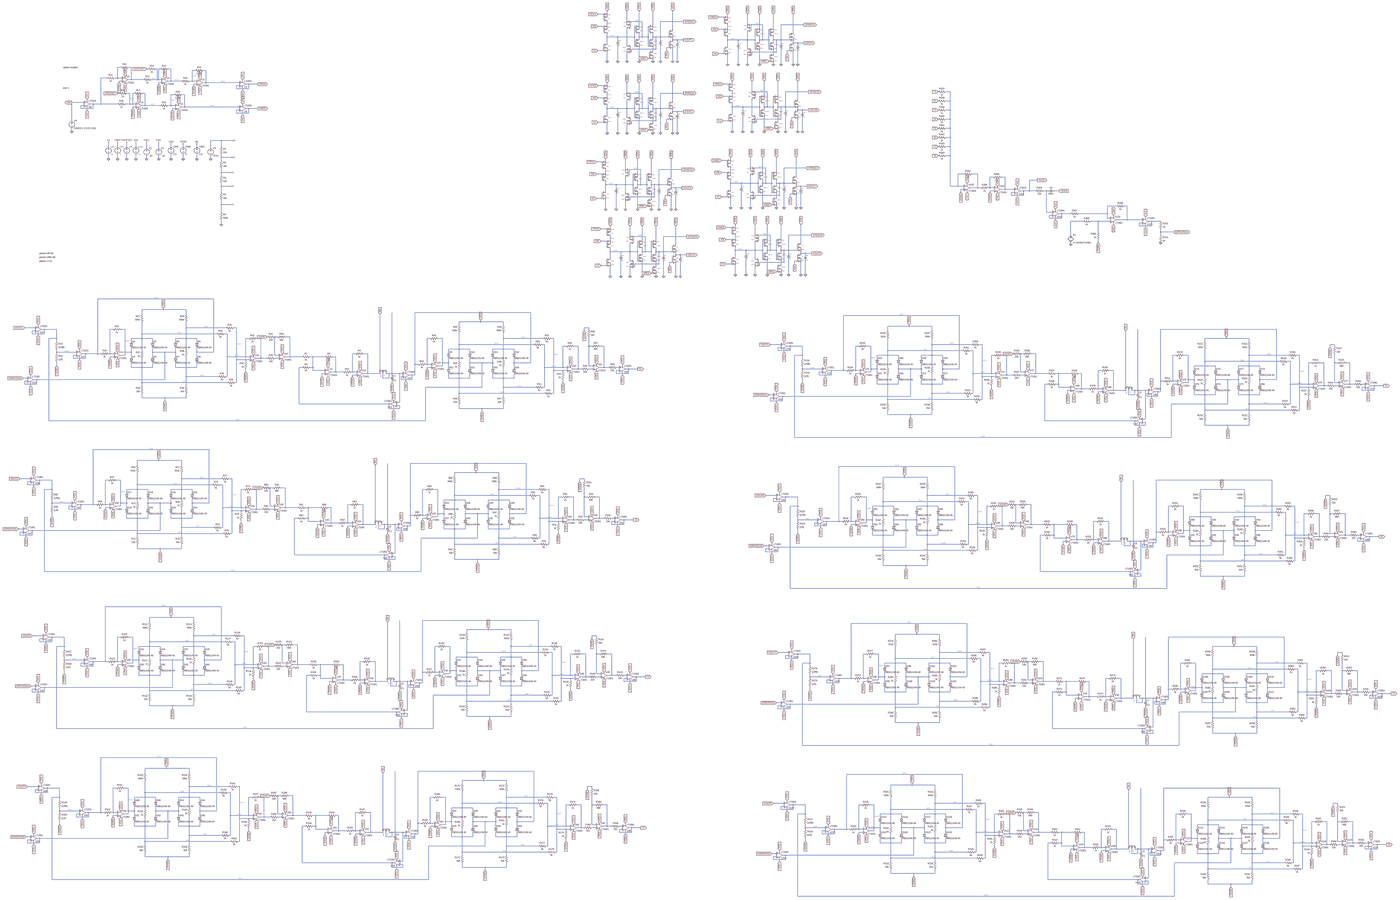
[diagram p0: schematic OZ_8_bounded_curves.asc, whole sheet]
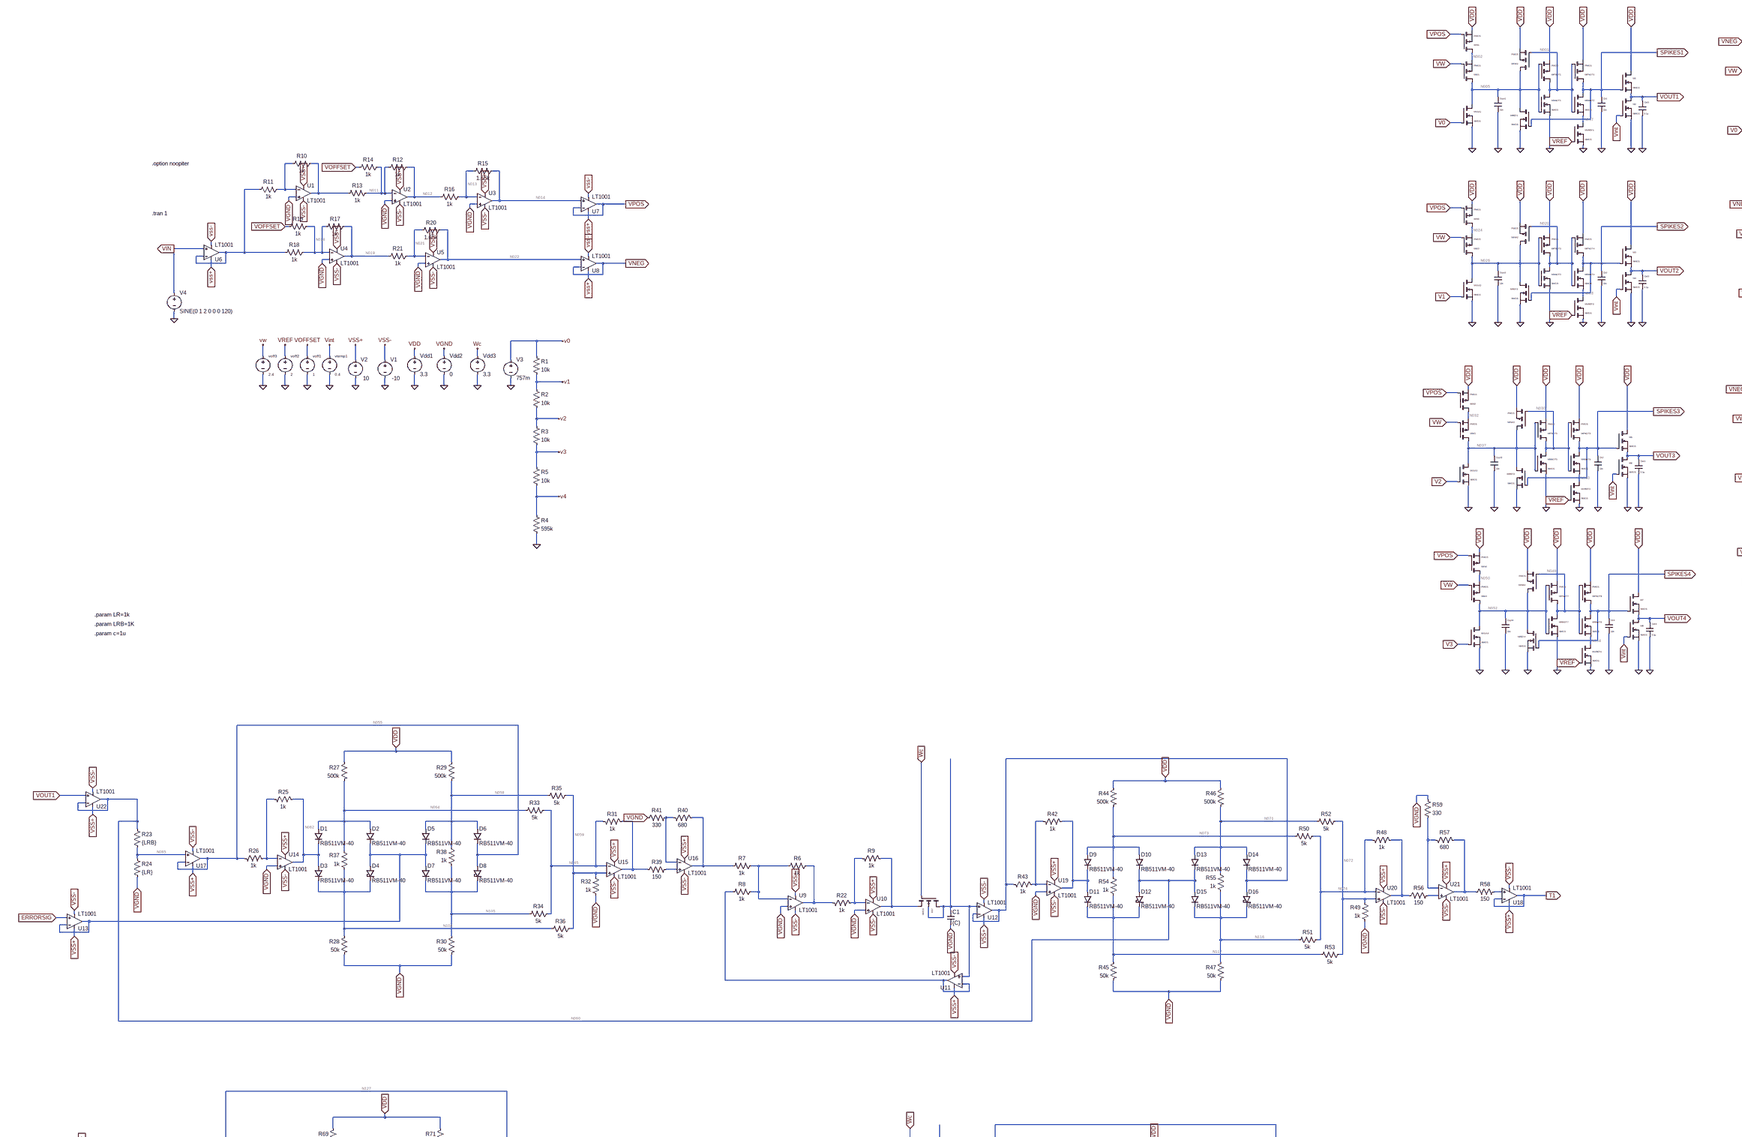
[diagram p1: schematic OZ_8_bounded_curves.asc, part, row 1 of 2, column 1 of 2]
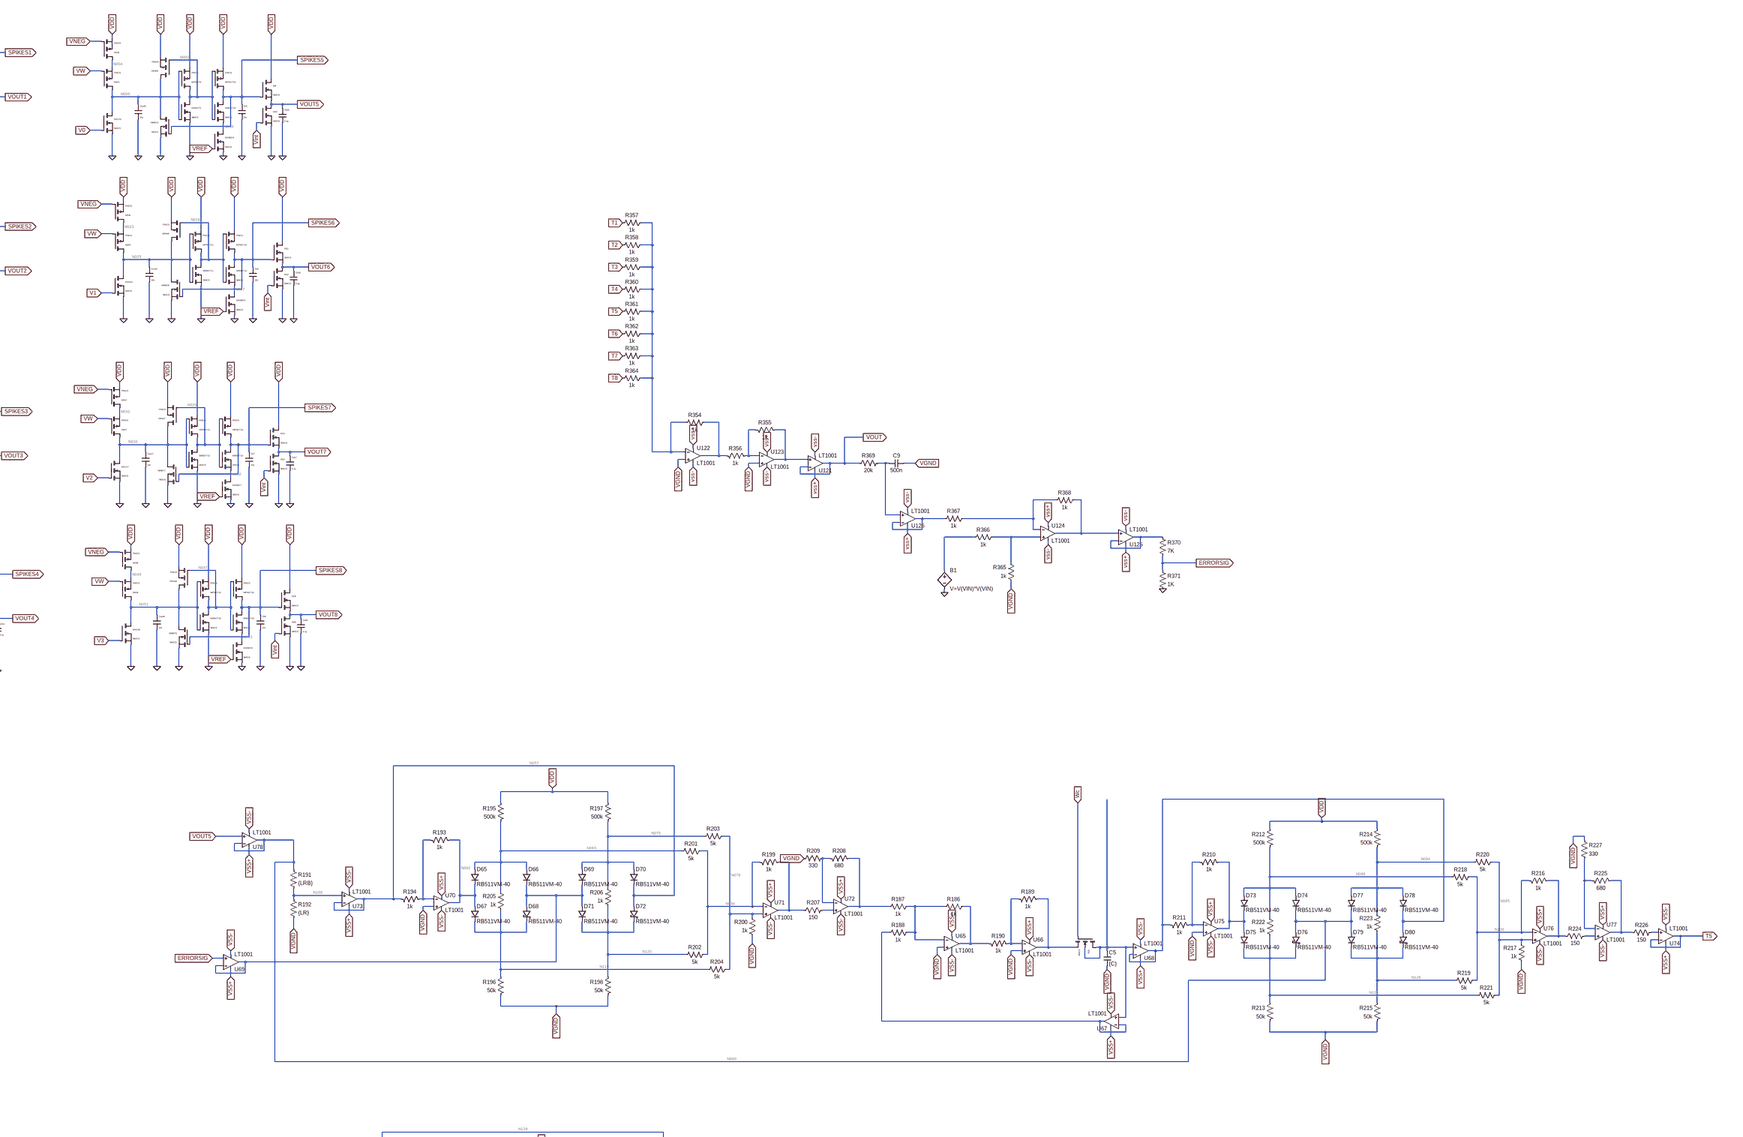
[diagram p2: schematic OZ_8_bounded_curves.asc, part, row 1 of 2, column 2 of 2]
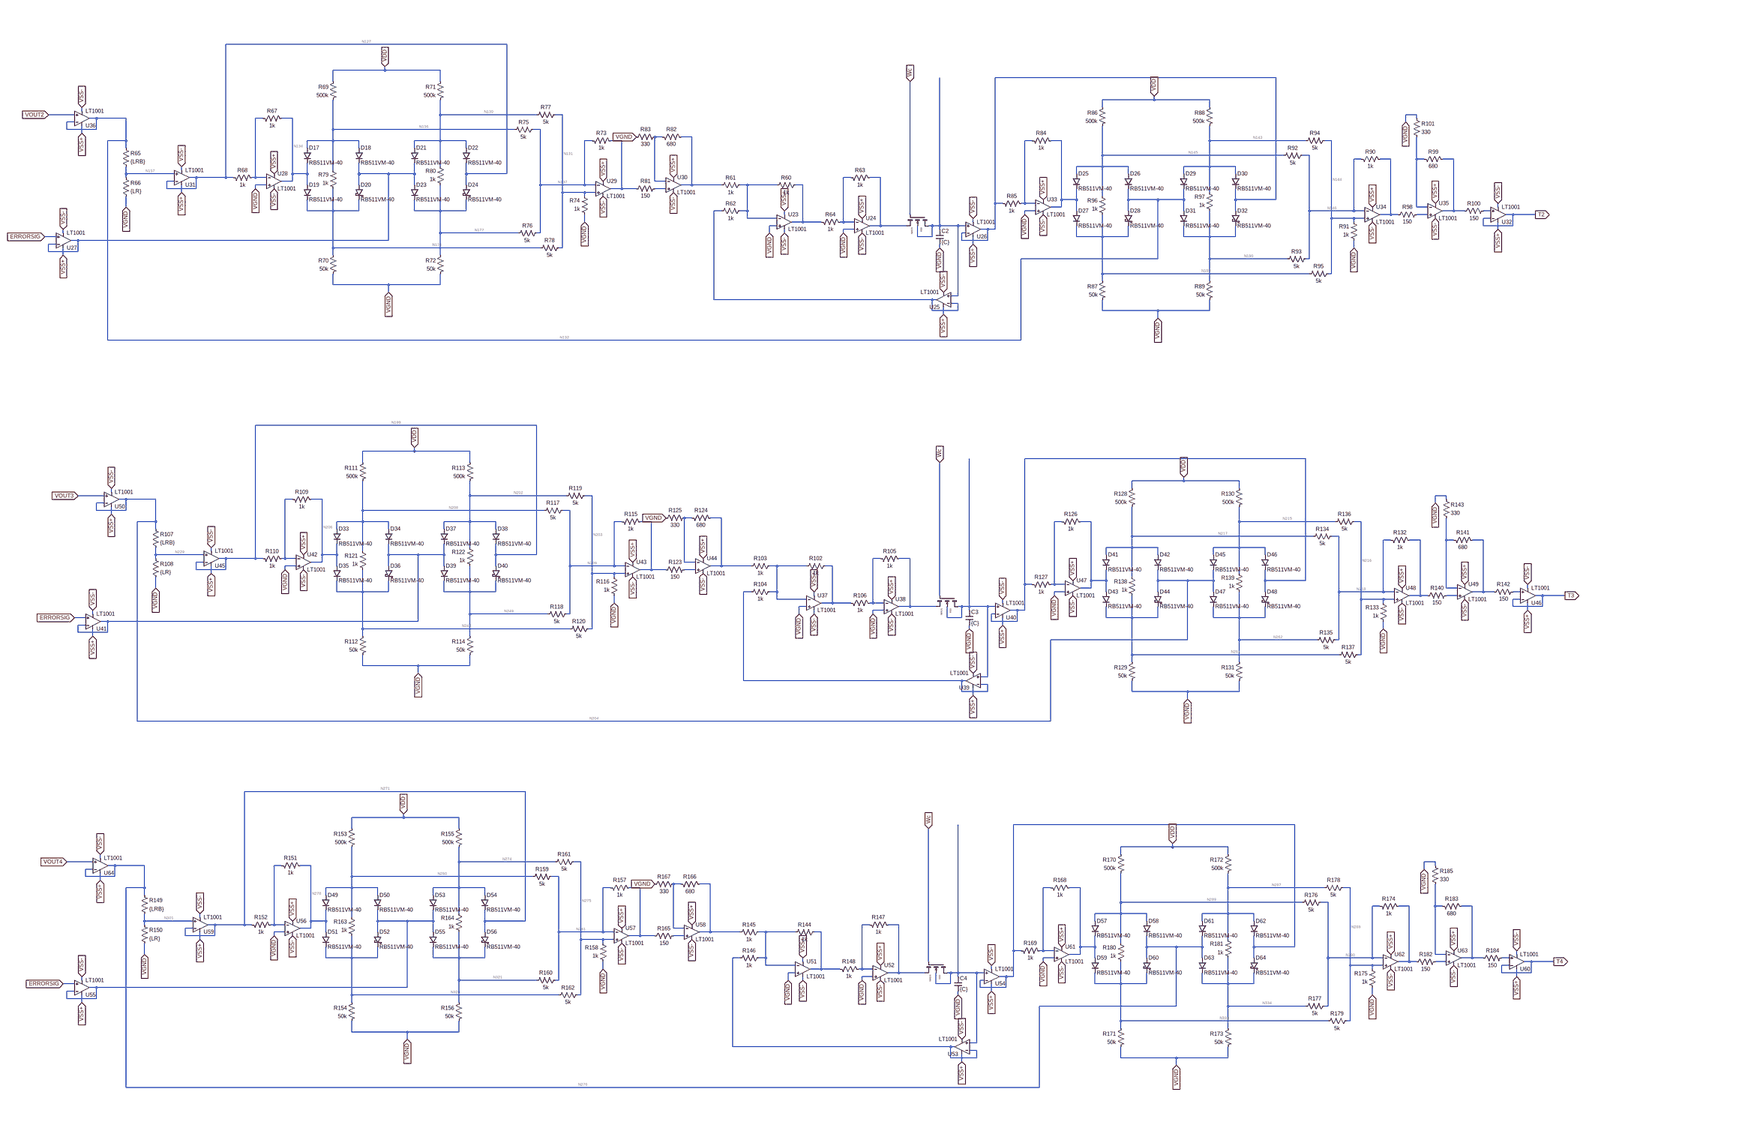
[diagram p3: schematic OZ_8_bounded_curves.asc, part, row 2 of 2, column 1 of 2]
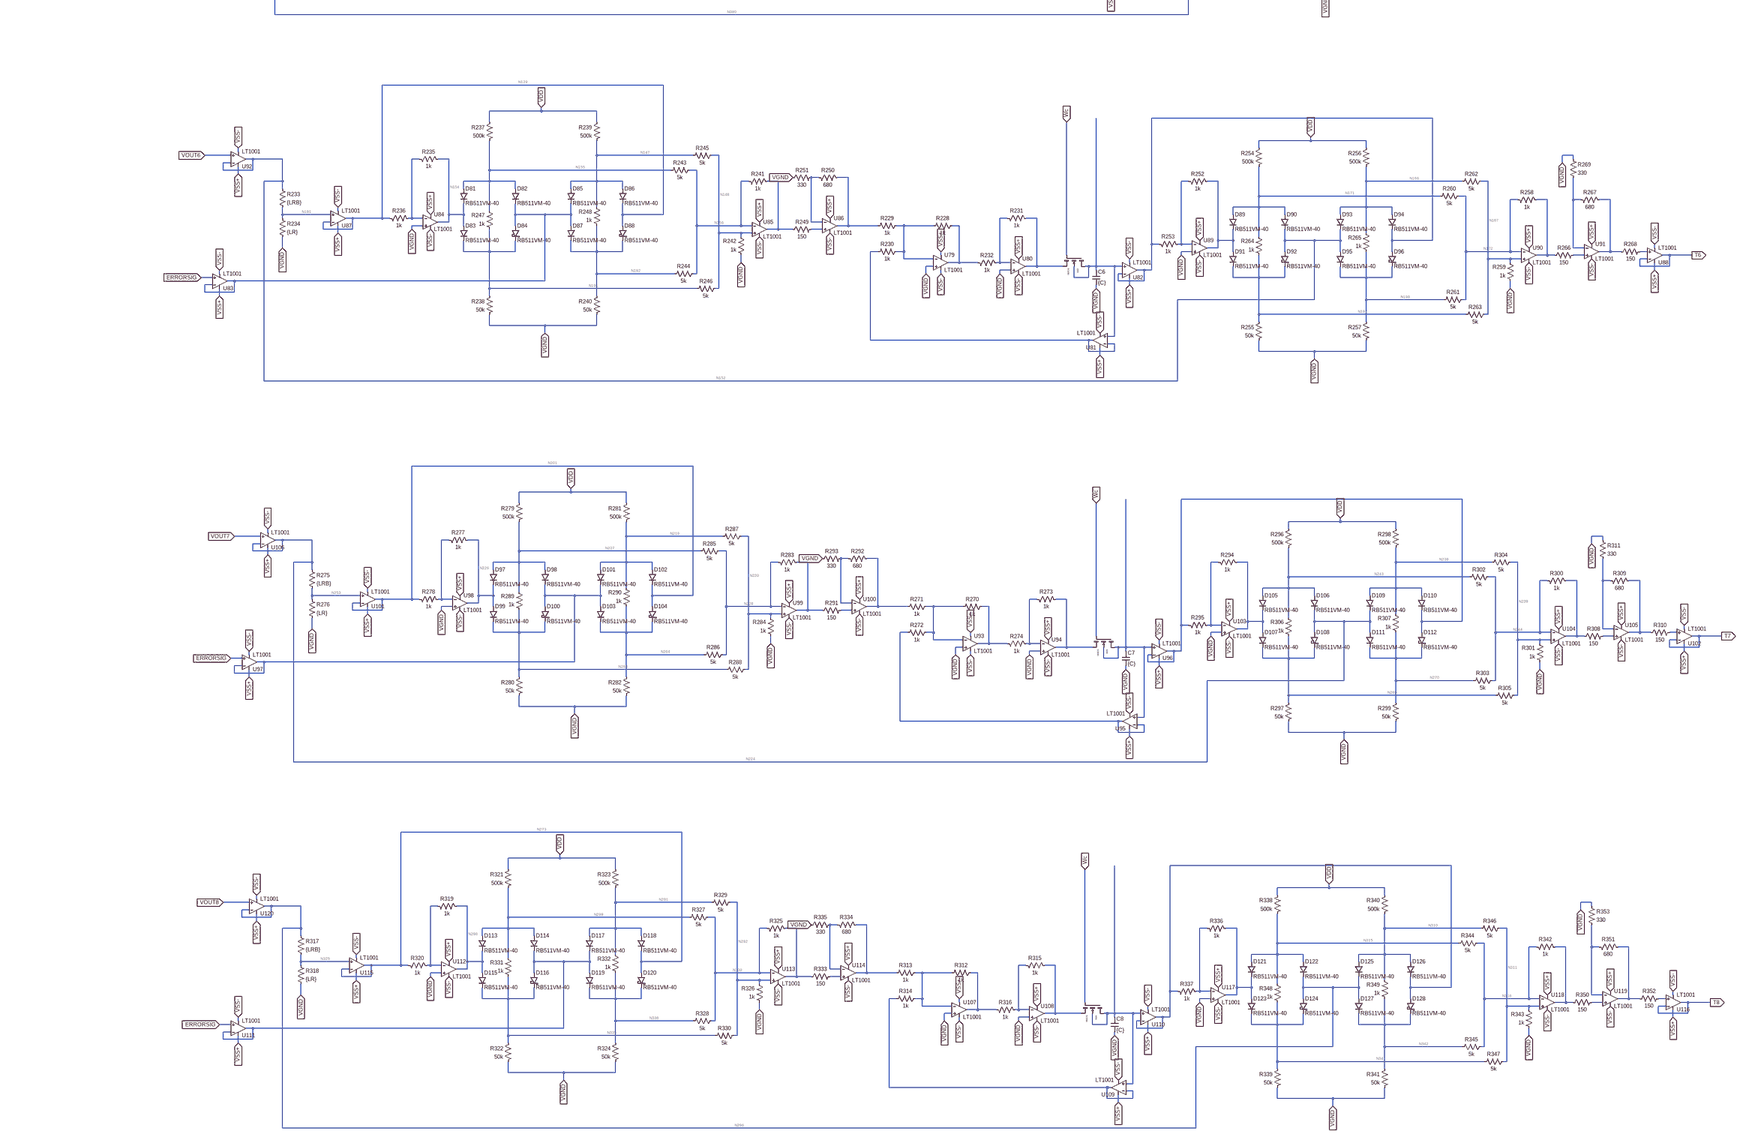
[diagram p4: schematic OZ_8_bounded_curves.asc, part, row 2 of 2, column 2 of 2]
* OZ_8_bounded_curves.asc
vtemp1 Vint 0 0.4
Vdd1 VDD 0 3.3
V1 VSS- 0 -10
V2 VSS+ 0 10
voff1 VOFFSET 0 1
voff2 VREF 0 2
voff3 vw 0 2.4
Vdd2 VGND 0 0
XU1 VGND N009 VSS+ VSS- N010 LT1001  ; pins In+ In- V+ V- OUT
R10 N010 N009 1k
R11 N009 N015 1k
XU2 VGND N011 VSS+ VSS- N012 LT1001  ; pins In+ In- V+ V- OUT
R12 N012 N011 1k
R13 N011 N010 1k
R14 N011 VOFFSET 1k
XU3 VGND N013 VSS+ VSS- N014 LT1001  ; pins In+ In- V+ V- OUT
R15 N014 N013 1.65k
R16 N013 N012 1k
XU4 VGND N018 VSS+ VSS- N019 LT1001  ; pins In+ In- V+ V- OUT
R17 N019 N018 1k
R18 N018 N015 1k
R19 N018 VOFFSET 1k
XU5 VGND N021 VSS+ VSS- N022 LT1001  ; pins In+ In- V+ V- OUT
R20 N022 N021 1.65k
R21 N021 N019 1k
XU6 VIN N015 VSS+ VSS- N015 LT1001  ; pins In+ In- V+ V- OUT
XU7 N014 VPOS VSS+ VSS- VPOS LT1001  ; pins In+ In- V+ V- OUT
XU8 N022 VNEG VSS+ VSS- VNEG LT1001  ; pins In+ In- V+ V- OUT
MW1 N005 vw N002 N002 PMOS
Csyn1 N005 0 10n V=4 Irms=162m Rser=0.395426 Lser=0 mfg="KEMET" pn="C0402C103K7PAC" type="X5R" IC=0
Ck1 SPIKES1 0 10n
MPNOT1 N001 N005 VDD VDD PMOS
MNNOT1 N001 N005 0 0 NMOS
MVREF1 N007 VREF 0 0 NMOS
MREF1 N005 SPIKES1 0 0 NMOS
MVLK1 N005 V0 0 0 NMOS
MINA1 N005 N001 VDD VDD PMOS
MIN1 N002 VPOS VDD VDD PMOS
MPNOT2 SPIKES1 N001 VDD VDD PMOS
MNNOT2 SPIKES1 N001 N007 N007 NMOS
M1 VDD SPIKES1 VOUT1 VOUT1 NMOS
M2 VOUT1 Vint 0 0 NMOS
Cint1 VOUT1 0 0.1µ
MW2 N026 vw N024 N024 PMOS
Csyn2 N026 0 10n V=4 Irms=162m Rser=0.395426 Lser=0 mfg="KEMET" pn="C0402C103K7PAC" type="X5R" IC=0
Ck2 SPIKES2 0 10n
MPNOT3 N020 N026 VDD VDD PMOS
MNNOT3 N020 N026 0 0 NMOS
MVREF2 N028 VREF 0 0 NMOS
MREF2 N026 SPIKES2 0 0 NMOS
MVLK2 N026 V1 0 0 NMOS
MINA2 N026 N020 VDD VDD PMOS
MIN2 N024 VPOS VDD VDD PMOS
MPNOT4 SPIKES2 N020 VDD VDD PMOS
MNNOT4 SPIKES2 N020 N028 N028 NMOS
M3 VDD SPIKES2 VOUT2 VOUT2 NMOS
M4 VOUT2 Vint 0 0 NMOS
Cint2 VOUT2 0 0.1µ
MW3 N037 vw N032 N032 PMOS
Csyn3 N037 0 10n V=4 Irms=162m Rser=0.395426 Lser=0 mfg="KEMET" pn="C0402C103K7PAC" type="X5R" IC=0
Ck3 SPIKES3 0 10n
MPNOT5 N030 N037 VDD VDD PMOS
MNNOT5 N030 N037 0 0 NMOS
MVREF3 N040 VREF 0 0 NMOS
MREF3 N037 SPIKES3 0 0 NMOS
MVLK3 N037 V2 0 0 NMOS
MINA3 N037 N030 VDD VDD PMOS
MIN3 N032 VPOS VDD VDD PMOS
MPNOT6 SPIKES3 N030 VDD VDD PMOS
MNNOT6 SPIKES3 N030 N040 N040 NMOS
M5 VDD SPIKES3 VOUT3 VOUT3 NMOS
M6 VOUT3 Vint 0 0 NMOS
Cint3 VOUT3 0 0.1µ
MW4 N052 vw N050 N050 PMOS
Csyn4 N052 0 10n V=4 Irms=162m Rser=0.395426 Lser=0 mfg="KEMET" pn="C0402C103K7PAC" type="X5R" IC=0
Ck4 SPIKES4 0 10n
MPNOT7 N048 N052 VDD VDD PMOS
MNNOT7 N048 N052 0 0 NMOS
MVREF4 N054 VREF 0 0 NMOS
MREF4 N052 SPIKES4 0 0 NMOS
MVLK4 N052 V3 0 0 NMOS
MINA4 N052 N048 VDD VDD PMOS
MIN4 N050 VPOS VDD VDD PMOS
MPNOT8 SPIKES4 N048 VDD VDD PMOS
MNNOT8 SPIKES4 N048 N054 N054 NMOS
M7 VDD SPIKES4 VOUT4 VOUT4 NMOS
M8 VOUT4 Vint 0 0 NMOS
Cint4 VOUT4 0 0.1µ
MW5 N006 vw N004 N004 PMOS
Csyn5 N006 0 10n V=4 Irms=162m Rser=0.395426 Lser=0 mfg="KEMET" pn="C0402C103K7PAC" type="X5R" IC=0
Ck5 SPIKES5 0 10n
MPNOT9 N003 N006 VDD VDD PMOS
MNNOT9 N003 N006 0 0 NMOS
MVREF5 N008 VREF 0 0 NMOS
MREF5 N006 SPIKES5 0 0 NMOS
MVLK5 N006 V0 0 0 NMOS
MINA5 N006 N003 VDD VDD PMOS
MIN5 N004 VNEG VDD VDD PMOS
MPNOT10 SPIKES5 N003 VDD VDD PMOS
MNNOT10 SPIKES5 N003 N008 N008 NMOS
M9 VDD SPIKES5 VOUT5 VOUT5 NMOS
M10 VOUT5 Vint 0 0 NMOS
Cint5 VOUT5 0 0.1µ
MW6 N025 vw N023 N023 PMOS
Csyn6 N025 0 10n V=4 Irms=162m Rser=0.395426 Lser=0 mfg="KEMET" pn="C0402C103K7PAC" type="X5R" IC=0
Ck6 SPIKES6 0 10n
MPNOT11 N016 N025 VDD VDD PMOS
MNNOT11 N016 N025 0 0 NMOS
MVREF6 N027 VREF 0 0 NMOS
MREF6 N025 SPIKES6 0 0 NMOS
MVLK6 N025 V1 0 0 NMOS
MINA6 N025 N016 VDD VDD PMOS
MIN6 N023 VNEG VDD VDD PMOS
MPNOT12 SPIKES6 N016 VDD VDD PMOS
MNNOT12 SPIKES6 N016 N027 N027 NMOS
M11 VDD SPIKES6 VOUT6 VOUT6 NMOS
M12 VOUT6 Vint 0 0 NMOS
Cint6 VOUT6 0 0.1µ
MW7 N036 vw N031 N031 PMOS
Csyn7 N036 0 10n V=4 Irms=162m Rser=0.395426 Lser=0 mfg="KEMET" pn="C0402C103K7PAC" type="X5R" IC=0
Ck7 SPIKES7 0 10n
MPNOT13 N029 N036 VDD VDD PMOS
MNNOT13 N029 N036 0 0 NMOS
MVREF7 N039 VREF 0 0 NMOS
MREF7 N036 SPIKES7 0 0 NMOS
MVLK7 N036 V2 0 0 NMOS
MINA7 N036 N029 VDD VDD PMOS
MIN7 N031 VNEG VDD VDD PMOS
MPNOT14 SPIKES7 N029 VDD VDD PMOS
MNNOT14 SPIKES7 N029 N039 N039 NMOS
M13 VDD SPIKES7 VOUT7 VOUT7 NMOS
M14 VOUT7 Vint 0 0 NMOS
Cint7 VOUT7 0 0.1µ
MW8 N051 vw N049 N049 PMOS
Csyn8 N051 0 10n V=4 Irms=162m Rser=0.395426 Lser=0 mfg="KEMET" pn="C0402C103K7PAC" type="X5R" IC=0
Ck8 SPIKES8 0 10n
MPNOT15 N047 N051 VDD VDD PMOS
MNNOT15 N047 N051 0 0 NMOS
MVREF8 N053 VREF 0 0 NMOS
MREF8 N051 SPIKES8 0 0 NMOS
MVLK8 N051 V3 0 0 NMOS
MINA8 N051 N047 VDD VDD PMOS
MIN8 N049 VNEG VDD VDD PMOS
MPNOT16 SPIKES8 N047 VDD VDD PMOS
MNNOT16 SPIKES8 N047 N053 N053 NMOS
M15 VDD SPIKES8 VOUT8 VOUT8 NMOS
M16 VOUT8 Vint 0 0 NMOS
Cint8 VOUT8 0 0.1µ
V3 V0 0 757m
R1 V0 V1 10k
R2 V1 V2 10k
R3 V2 V3 10k
R4 v4 0 595k
R5 V3 v4 10k
V4 VIN 0 SINE(0 1 2 0 0 0 120)
XU121 N035 VOUT VSS+ VSS- VOUT LT1001  ; pins In+ In- V+ V- OUT
XU122 VGND N017 VSS+ VSS- N033 LT1001  ; pins In+ In- V+ V- OUT
R354 N033 N017 1k
XU123 VGND N034 VSS+ VSS- N035 LT1001  ; pins In+ In- V+ V- OUT
R355 N034 N035 1k
R356 N033 N034 1k
R357 N017 T1 1k
R358 N017 T2 1k
R359 N017 T3 1k
R360 N017 T4 1k
R361 N017 T5 1k
R362 N017 T6 1k
R363 N017 T7 1k
R364 N017 T8 1k
M17 N113 Wc N088 N113 NMOS
C1 N113 VGND {C} IC=0
XU9 VGND N096 VSS+ VSS- N097 LT1001  ; pins In+ In- V+ V- OUT
R6 N097 N096 1k
R7 N096 N067 1k
R8 N096 N106 1k
XU10 VGND N087 VSS+ VSS- N088 LT1001  ; pins In+ In- V+ V- OUT
R9 N087 N088 1k
R22 N097 N087 1k
XU11 N113 N106 VSS+ VSS- N106 LT1001  ; pins In+ In- V+ V- OUT
XU12 N113 N056 VSS+ VSS- N056 LT1001  ; pins In+ In- V+ V- OUT
R23 N060 N085 {LRB}
R24 N085 VGND {LR}
XU13 ERRORSIG N086 VSS+ VSS- N086 LT1001  ; pins In+ In- V+ V- OUT
D1 N064 N062 RB511VM-40
XU14 VGND N061 VSS+ VSS- N062 LT1001  ; pins In+ In- V+ V- OUT
R25 N061 N062 1k
R26 N055 N061 1k
D2 N064 N086 RB511VM-40
D3 N062 N104 RB511VM-40
D4 N086 N104 RB511VM-40
R27 VDD N064 500k
R28 N104 VGND 50k
D5 N058 N086 RB511VM-40
D6 N058 N055 RB511VM-40
D7 N086 N105 RB511VM-40
D8 N055 N105 RB511VM-40
R29 VDD N058 500k
R30 N105 VGND 50k
XU15 N059 N065 VSS+ VSS- N068 LT1001  ; pins In+ In- V+ V- OUT
R31 N065 N068 1k
R32 VGND N059 1k
R33 N065 N064 5k
R34 N065 N105 5k
R35 N059 N058 5k
R36 N059 N104 5k
R37 N104 N064 1k
R38 N105 N058 1k
R39 N068 N098 150
XU16 N098 N066 VSS+ VSS- N067 LT1001  ; pins In+ In- V+ V- OUT
R40 N066 N067 680
R41 VGND N066 330
XU17 N085 N055 VSS+ VSS- N055 LT1001  ; pins In+ In- V+ V- OUT
XU18 N107 T1 VSS+ VSS- T1 LT1001  ; pins In+ In- V+ V- OUT
D9 N073 N070 RB511VM-40
XU19 VGND N069 VSS+ VSS- N070 LT1001  ; pins In+ In- V+ V- OUT
R42 N069 N070 1k
R43 N056 N069 1k
D10 N073 N060 RB511VM-40
D11 N070 N117 RB511VM-40
D12 N060 N117 RB511VM-40
R44 VDD N073 500k
R45 N117 VGND 50k
D13 N071 N060 RB511VM-40
D14 N071 N056 RB511VM-40
D15 N060 N118 RB511VM-40
D16 N056 N118 RB511VM-40
R46 VDD N071 500k
R47 N118 VGND 50k
XU20 N072 N074 VSS+ VSS- N077 LT1001  ; pins In+ In- V+ V- OUT
R48 N074 N077 1k
R49 VGND N072 1k
R50 N074 N073 5k
R51 N074 N118 5k
R52 N072 N071 5k
R53 N072 N117 5k
R54 N117 N073 1k
R55 N118 N071 1k
R56 N077 N108 150
XU21 N108 N078 VSS+ VSS- N079 LT1001  ; pins In+ In- V+ V- OUT
R57 N078 N079 680
R58 N079 N107 150
R59 VGND N078 330
XU22 VOUT1 N060 VSS+ VSS- N060 LT1001  ; pins In+ In- V+ V- OUT
M18 N185 Wc N160 N185 NMOS
C2 N185 VGND {C} IC=0
XU23 VGND N168 VSS+ VSS- N169 LT1001  ; pins In+ In- V+ V- OUT
R60 N169 N168 1k
R61 N168 N139 1k
R62 N168 N178 1k
XU24 VGND N159 VSS+ VSS- N160 LT1001  ; pins In+ In- V+ V- OUT
R63 N159 N160 1k
R64 N169 N159 1k
XU25 N185 N178 VSS+ VSS- N178 LT1001  ; pins In+ In- V+ V- OUT
XU26 N185 N128 VSS+ VSS- N128 LT1001  ; pins In+ In- V+ V- OUT
R65 N132 N157 {LRB}
R66 N157 VGND {LR}
XU27 ERRORSIG N158 VSS+ VSS- N158 LT1001  ; pins In+ In- V+ V- OUT
D17 N136 N134 RB511VM-40
XU28 VGND N133 VSS+ VSS- N134 LT1001  ; pins In+ In- V+ V- OUT
R67 N133 N134 1k
R68 N127 N133 1k
D18 N136 N158 RB511VM-40
D19 N134 N176 RB511VM-40
D20 N158 N176 RB511VM-40
R69 VDD N136 500k
R70 N176 VGND 50k
D21 N130 N158 RB511VM-40
D22 N130 N127 RB511VM-40
D23 N158 N177 RB511VM-40
D24 N127 N177 RB511VM-40
R71 VDD N130 500k
R72 N177 VGND 50k
XU29 N131 N137 VSS+ VSS- N140 LT1001  ; pins In+ In- V+ V- OUT
R73 N137 N140 1k
R74 VGND N131 1k
R75 N137 N136 5k
R76 N137 N177 5k
R77 N131 N130 5k
R78 N131 N176 5k
R79 N176 N136 1k
R80 N177 N130 1k
R81 N140 N170 150
XU30 N170 N138 VSS+ VSS- N139 LT1001  ; pins In+ In- V+ V- OUT
R82 N138 N139 680
R83 VGND N138 330
XU31 N157 N127 VSS+ VSS- N127 LT1001  ; pins In+ In- V+ V- OUT
XU32 N179 T2 VSS+ VSS- T2 LT1001  ; pins In+ In- V+ V- OUT
D25 N145 N142 RB511VM-40
XU33 VGND N141 VSS+ VSS- N142 LT1001  ; pins In+ In- V+ V- OUT
R84 N141 N142 1k
R85 N128 N141 1k
D26 N145 N132 RB511VM-40
D27 N142 N189 RB511VM-40
D28 N132 N189 RB511VM-40
R86 VDD N145 500k
R87 N189 VGND 50k
D29 N143 N132 RB511VM-40
D30 N143 N128 RB511VM-40
D31 N132 N190 RB511VM-40
D32 N128 N190 RB511VM-40
R88 VDD N143 500k
R89 N190 VGND 50k
XU34 N144 N146 VSS+ VSS- N149 LT1001  ; pins In+ In- V+ V- OUT
R90 N146 N149 1k
R91 VGND N144 1k
R92 N146 N145 5k
R93 N146 N190 5k
R94 N144 N143 5k
R95 N144 N189 5k
R96 N189 N145 1k
R97 N190 N143 1k
R98 N149 N180 150
XU35 N180 N150 VSS+ VSS- N151 LT1001  ; pins In+ In- V+ V- OUT
R99 N150 N151 680
R100 N151 N179 150
R101 VGND N150 330
XU36 VOUT2 N132 VSS+ VSS- N132 LT1001  ; pins In+ In- V+ V- OUT
M19 N257 Wc N232 N257 NMOS
C3 N257 VGND {C} IC=0
XU37 VGND N240 VSS+ VSS- N241 LT1001  ; pins In+ In- V+ V- OUT
R102 N241 N240 1k
R103 N240 N211 1k
R104 N240 N250 1k
XU38 VGND N231 VSS+ VSS- N232 LT1001  ; pins In+ In- V+ V- OUT
R105 N231 N232 1k
R106 N241 N231 1k
XU39 N257 N250 VSS+ VSS- N250 LT1001  ; pins In+ In- V+ V- OUT
XU40 N257 N200 VSS+ VSS- N200 LT1001  ; pins In+ In- V+ V- OUT
R107 N204 N229 {LRB}
R108 N229 VGND {LR}
XU41 ERRORSIG N230 VSS+ VSS- N230 LT1001  ; pins In+ In- V+ V- OUT
D33 N208 N206 RB511VM-40
XU42 VGND N205 VSS+ VSS- N206 LT1001  ; pins In+ In- V+ V- OUT
R109 N205 N206 1k
R110 N199 N205 1k
D34 N208 N230 RB511VM-40
D35 N206 N248 RB511VM-40
D36 N230 N248 RB511VM-40
R111 VDD N208 500k
R112 N248 VGND 50k
D37 N202 N230 RB511VM-40
D38 N202 N199 RB511VM-40
D39 N230 N249 RB511VM-40
D40 N199 N249 RB511VM-40
R113 VDD N202 500k
R114 N249 VGND 50k
XU43 N203 N209 VSS+ VSS- N212 LT1001  ; pins In+ In- V+ V- OUT
R115 N209 N212 1k
R116 VGND N203 1k
R117 N209 N208 5k
R118 N209 N249 5k
R119 N203 N202 5k
R120 N203 N248 5k
R121 N248 N208 1k
R122 N249 N202 1k
R123 N212 N242 150
XU44 N242 N210 VSS+ VSS- N211 LT1001  ; pins In+ In- V+ V- OUT
R124 N210 N211 680
R125 VGND N210 330
XU45 N229 N199 VSS+ VSS- N199 LT1001  ; pins In+ In- V+ V- OUT
XU46 N251 T3 VSS+ VSS- T3 LT1001  ; pins In+ In- V+ V- OUT
D41 N217 N214 RB511VM-40
XU47 VGND N213 VSS+ VSS- N214 LT1001  ; pins In+ In- V+ V- OUT
R126 N213 N214 1k
R127 N200 N213 1k
D42 N217 N204 RB511VM-40
D43 N214 N261 RB511VM-40
D44 N204 N261 RB511VM-40
R128 VDD N217 500k
R129 N261 VGND 50k
D45 N215 N204 RB511VM-40
D46 N215 N200 RB511VM-40
D47 N204 N262 RB511VM-40
D48 N200 N262 RB511VM-40
R130 VDD N215 500k
R131 N262 VGND 50k
XU48 N216 N218 VSS+ VSS- N221 LT1001  ; pins In+ In- V+ V- OUT
R132 N218 N221 1k
R133 VGND N216 1k
R134 N218 N217 5k
R135 N218 N262 5k
R136 N216 N215 5k
R137 N216 N261 5k
R138 N261 N217 1k
R139 N262 N215 1k
R140 N221 N252 150
XU49 N252 N222 VSS+ VSS- N223 LT1001  ; pins In+ In- V+ V- OUT
R141 N222 N223 680
R142 N223 N251 150
R143 VGND N222 330
XU50 VOUT3 N204 VSS+ VSS- N204 LT1001  ; pins In+ In- V+ V- OUT
M20 N329 Wc N304 N329 NMOS
C4 N329 VGND {C} IC=0
XU51 VGND N312 VSS+ VSS- N313 LT1001  ; pins In+ In- V+ V- OUT
R144 N313 N312 1k
R145 N312 N283 1k
R146 N312 N322 1k
XU52 VGND N303 VSS+ VSS- N304 LT1001  ; pins In+ In- V+ V- OUT
R147 N303 N304 1k
R148 N313 N303 1k
XU53 N329 N322 VSS+ VSS- N322 LT1001  ; pins In+ In- V+ V- OUT
XU54 N329 N272 VSS+ VSS- N272 LT1001  ; pins In+ In- V+ V- OUT
R149 N276 N301 {LRB}
R150 N301 VGND {LR}
XU55 ERRORSIG N302 VSS+ VSS- N302 LT1001  ; pins In+ In- V+ V- OUT
D49 N280 N278 RB511VM-40
XU56 VGND N277 VSS+ VSS- N278 LT1001  ; pins In+ In- V+ V- OUT
R151 N277 N278 1k
R152 N271 N277 1k
D50 N280 N302 RB511VM-40
D51 N278 N320 RB511VM-40
D52 N302 N320 RB511VM-40
R153 VDD N280 500k
R154 N320 VGND 50k
D53 N274 N302 RB511VM-40
D54 N274 N271 RB511VM-40
D55 N302 N321 RB511VM-40
D56 N271 N321 RB511VM-40
R155 VDD N274 500k
R156 N321 VGND 50k
XU57 N275 N281 VSS+ VSS- N284 LT1001  ; pins In+ In- V+ V- OUT
R157 N281 N284 1k
R158 VGND N275 1k
R159 N281 N280 5k
R160 N281 N321 5k
R161 N275 N274 5k
R162 N275 N320 5k
R163 N320 N280 1k
R164 N321 N274 1k
R165 N284 N314 150
XU58 N314 N282 VSS+ VSS- N283 LT1001  ; pins In+ In- V+ V- OUT
R166 N282 N283 680
R167 VGND N282 330
XU59 N301 N271 VSS+ VSS- N271 LT1001  ; pins In+ In- V+ V- OUT
XU60 N323 T4 VSS+ VSS- T4 LT1001  ; pins In+ In- V+ V- OUT
D57 N289 N286 RB511VM-40
XU61 VGND N285 VSS+ VSS- N286 LT1001  ; pins In+ In- V+ V- OUT
R168 N285 N286 1k
R169 N272 N285 1k
D58 N289 N276 RB511VM-40
D59 N286 N333 RB511VM-40
D60 N276 N333 RB511VM-40
R170 VDD N289 500k
R171 N333 VGND 50k
D61 N287 N276 RB511VM-40
D62 N287 N272 RB511VM-40
D63 N276 N334 RB511VM-40
D64 N272 N334 RB511VM-40
R172 VDD N287 500k
R173 N334 VGND 50k
XU62 N288 N290 VSS+ VSS- N293 LT1001  ; pins In+ In- V+ V- OUT
R174 N290 N293 1k
R175 VGND N288 1k
R176 N290 N289 5k
R177 N290 N334 5k
R178 N288 N287 5k
R179 N288 N333 5k
R180 N333 N289 1k
R181 N334 N287 1k
R182 N293 N324 150
XU63 N324 N294 VSS+ VSS- N295 LT1001  ; pins In+ In- V+ V- OUT
R183 N294 N295 680
R184 N295 N323 150
R185 VGND N294 330
XU64 VOUT4 N276 VSS+ VSS- N276 LT1001  ; pins In+ In- V+ V- OUT
M21 N124 Wc N112 N124 NMOS
C5 N124 VGND {C} IC=0
XU65 VGND N114 VSS+ VSS- N115 LT1001  ; pins In+ In- V+ V- OUT
R186 N115 N114 1k
R187 N114 N090 1k
R188 N114 N121 1k
XU66 VGND N111 VSS+ VSS- N112 LT1001  ; pins In+ In- V+ V- OUT
R189 N111 N112 1k
R190 N115 N111 1k
XU67 N124 N121 VSS+ VSS- N121 LT1001  ; pins In+ In- V+ V- OUT
XU68 N124 N063 VSS+ VSS- N063 LT1001  ; pins In+ In- V+ V- OUT
R191 N080 N109 {LRB}
R192 N109 VGND {LR}
XU69 ERRORSIG N110 VSS+ VSS- N110 LT1001  ; pins In+ In- V+ V- OUT
D65 N083 N082 RB511VM-40
XU70 VGND N081 VSS+ VSS- N082 LT1001  ; pins In+ In- V+ V- OUT
R193 N081 N082 1k
R194 N057 N081 1k
D66 N083 N110 RB511VM-40
D67 N082 N119 RB511VM-40
D68 N110 N119 RB511VM-40
R195 VDD N083 500k
R196 N119 VGND 50k
D69 N075 N110 RB511VM-40
D70 N075 N057 RB511VM-40
D71 N110 N120 RB511VM-40
D72 N057 N120 RB511VM-40
R197 VDD N075 500k
R198 N120 VGND 50k
XU71 N076 N084 VSS+ VSS- N091 LT1001  ; pins In+ In- V+ V- OUT
R199 N084 N091 1k
R200 VGND N076 1k
R201 N084 N083 5k
R202 N084 N120 5k
R203 N076 N075 5k
R204 N076 N119 5k
R205 N119 N083 1k
R206 N120 N075 1k
R207 N091 N116 150
XU72 N116 N089 VSS+ VSS- N090 LT1001  ; pins In+ In- V+ V- OUT
R208 N089 N090 680
R209 VGND N089 330
XU73 N109 N057 VSS+ VSS- N057 LT1001  ; pins In+ In- V+ V- OUT
XU74 N122 T5 VSS+ VSS- T5 LT1001  ; pins In+ In- V+ V- OUT
D73 N099 N093 RB511VM-40
XU75 VGND N092 VSS+ VSS- N093 LT1001  ; pins In+ In- V+ V- OUT
R210 N092 N093 1k
R211 N063 N092 1k
D74 N099 N080 RB511VM-40
D75 N093 N125 RB511VM-40
D76 N080 N125 RB511VM-40
R212 VDD N099 500k
R213 N125 VGND 50k
D77 N094 N080 RB511VM-40
D78 N094 N063 RB511VM-40
D79 N080 N126 RB511VM-40
D80 N063 N126 RB511VM-40
R214 VDD N094 500k
R215 N126 VGND 50k
XU76 N095 N100 VSS+ VSS- N101 LT1001  ; pins In+ In- V+ V- OUT
R216 N100 N101 1k
R217 VGND N095 1k
R218 N100 N099 5k
R219 N100 N126 5k
R220 N095 N094 5k
R221 N095 N125 5k
R222 N125 N099 1k
R223 N126 N094 1k
R224 N101 N123 150
XU77 N123 N102 VSS+ VSS- N103 LT1001  ; pins In+ In- V+ V- OUT
R225 N102 N103 680
R226 N103 N122 150
R227 VGND N102 330
XU78 VOUT5 N080 VSS+ VSS- N080 LT1001  ; pins In+ In- V+ V- OUT
M22 N196 Wc N184 N196 NMOS
C6 N196 VGND {C} IC=0
XU79 VGND N186 VSS+ VSS- N187 LT1001  ; pins In+ In- V+ V- OUT
R228 N187 N186 1k
R229 N186 N162 1k
R230 N186 N193 1k
XU80 VGND N183 VSS+ VSS- N184 LT1001  ; pins In+ In- V+ V- OUT
R231 N183 N184 1k
R232 N187 N183 1k
XU81 N196 N193 VSS+ VSS- N193 LT1001  ; pins In+ In- V+ V- OUT
XU82 N196 N135 VSS+ VSS- N135 LT1001  ; pins In+ In- V+ V- OUT
R233 N152 N181 {LRB}
R234 N181 VGND {LR}
XU83 ERRORSIG N182 VSS+ VSS- N182 LT1001  ; pins In+ In- V+ V- OUT
D81 N155 N154 RB511VM-40
XU84 VGND N153 VSS+ VSS- N154 LT1001  ; pins In+ In- V+ V- OUT
R235 N153 N154 1k
R236 N129 N153 1k
D82 N155 N182 RB511VM-40
D83 N154 N191 RB511VM-40
D84 N182 N191 RB511VM-40
R237 VDD N155 500k
R238 N191 VGND 50k
D85 N147 N182 RB511VM-40
D86 N147 N129 RB511VM-40
D87 N182 N192 RB511VM-40
D88 N129 N192 RB511VM-40
R239 VDD N147 500k
R240 N192 VGND 50k
XU85 N148 N156 VSS+ VSS- N163 LT1001  ; pins In+ In- V+ V- OUT
R241 N156 N163 1k
R242 VGND N148 1k
R243 N156 N155 5k
R244 N156 N192 5k
R245 N148 N147 5k
R246 N148 N191 5k
R247 N191 N155 1k
R248 N192 N147 1k
R249 N163 N188 150
XU86 N188 N161 VSS+ VSS- N162 LT1001  ; pins In+ In- V+ V- OUT
R250 N161 N162 680
R251 VGND N161 330
XU87 N181 N129 VSS+ VSS- N129 LT1001  ; pins In+ In- V+ V- OUT
XU88 N194 T6 VSS+ VSS- T6 LT1001  ; pins In+ In- V+ V- OUT
D89 N171 N165 RB511VM-40
XU89 VGND N164 VSS+ VSS- N165 LT1001  ; pins In+ In- V+ V- OUT
R252 N164 N165 1k
R253 N135 N164 1k
D90 N171 N152 RB511VM-40
D91 N165 N197 RB511VM-40
D92 N152 N197 RB511VM-40
R254 VDD N171 500k
R255 N197 VGND 50k
D93 N166 N152 RB511VM-40
D94 N166 N135 RB511VM-40
D95 N152 N198 RB511VM-40
D96 N135 N198 RB511VM-40
R256 VDD N166 500k
R257 N198 VGND 50k
XU90 N167 N172 VSS+ VSS- N173 LT1001  ; pins In+ In- V+ V- OUT
R258 N172 N173 1k
R259 VGND N167 1k
R260 N172 N171 5k
R261 N172 N198 5k
R262 N167 N166 5k
R263 N167 N197 5k
R264 N197 N171 1k
R265 N198 N166 1k
R266 N173 N195 150
XU91 N195 N174 VSS+ VSS- N175 LT1001  ; pins In+ In- V+ V- OUT
R267 N174 N175 680
R268 N175 N194 150
R269 VGND N174 330
XU92 VOUT6 N152 VSS+ VSS- N152 LT1001  ; pins In+ In- V+ V- OUT
M23 N268 Wc N256 N268 NMOS
C7 N268 VGND {C} IC=0
XU93 VGND N258 VSS+ VSS- N259 LT1001  ; pins In+ In- V+ V- OUT
R270 N259 N258 1k
R271 N258 N234 1k
R272 N258 N265 1k
XU94 VGND N255 VSS+ VSS- N256 LT1001  ; pins In+ In- V+ V- OUT
R273 N255 N256 1k
R274 N259 N255 1k
XU95 N268 N265 VSS+ VSS- N265 LT1001  ; pins In+ In- V+ V- OUT
XU96 N268 N207 VSS+ VSS- N207 LT1001  ; pins In+ In- V+ V- OUT
R275 N224 N253 {LRB}
R276 N253 VGND {LR}
XU97 ERRORSIG N254 VSS+ VSS- N254 LT1001  ; pins In+ In- V+ V- OUT
D97 N227 N226 RB511VM-40
XU98 VGND N225 VSS+ VSS- N226 LT1001  ; pins In+ In- V+ V- OUT
R277 N225 N226 1k
R278 N201 N225 1k
D98 N227 N254 RB511VM-40
D99 N226 N263 RB511VM-40
D100 N254 N263 RB511VM-40
R279 VDD N227 500k
R280 N263 VGND 50k
D101 N219 N254 RB511VM-40
D102 N219 N201 RB511VM-40
D103 N254 N264 RB511VM-40
D104 N201 N264 RB511VM-40
R281 VDD N219 500k
R282 N264 VGND 50k
XU99 N220 N228 VSS+ VSS- N235 LT1001  ; pins In+ In- V+ V- OUT
R283 N228 N235 1k
R284 VGND N220 1k
R285 N228 N227 5k
R286 N228 N264 5k
R287 N220 N219 5k
R288 N220 N263 5k
R289 N263 N227 1k
R290 N264 N219 1k
R291 N235 N260 150
XU100 N260 N233 VSS+ VSS- N234 LT1001  ; pins In+ In- V+ V- OUT
R292 N233 N234 680
R293 VGND N233 330
XU101 N253 N201 VSS+ VSS- N201 LT1001  ; pins In+ In- V+ V- OUT
XU102 N266 T7 VSS+ VSS- T7 LT1001  ; pins In+ In- V+ V- OUT
D105 N243 N237 RB511VM-40
XU103 VGND N236 VSS+ VSS- N237 LT1001  ; pins In+ In- V+ V- OUT
R294 N236 N237 1k
R295 N207 N236 1k
D106 N243 N224 RB511VM-40
D107 N237 N269 RB511VM-40
D108 N224 N269 RB511VM-40
R296 VDD N243 500k
R297 N269 VGND 50k
D109 N238 N224 RB511VM-40
D110 N238 N207 RB511VM-40
D111 N224 N270 RB511VM-40
D112 N207 N270 RB511VM-40
R298 VDD N238 500k
R299 N270 VGND 50k
XU104 N239 N244 VSS+ VSS- N245 LT1001  ; pins In+ In- V+ V- OUT
R300 N244 N245 1k
R301 VGND N239 1k
R302 N244 N243 5k
R303 N244 N270 5k
R304 N239 N238 5k
R305 N239 N269 5k
R306 N269 N243 1k
R307 N270 N238 1k
R308 N245 N267 150
XU105 N267 N246 VSS+ VSS- N247 LT1001  ; pins In+ In- V+ V- OUT
R309 N246 N247 680
R310 N247 N266 150
R311 VGND N246 330
XU106 VOUT7 N224 VSS+ VSS- N224 LT1001  ; pins In+ In- V+ V- OUT
M24 N340 Wc N328 N340 NMOS
C8 N340 VGND {C} IC=0
XU107 VGND N330 VSS+ VSS- N331 LT1001  ; pins In+ In- V+ V- OUT
R312 N331 N330 1k
R313 N330 N306 1k
R314 N330 N337 1k
XU108 VGND N327 VSS+ VSS- N328 LT1001  ; pins In+ In- V+ V- OUT
R315 N327 N328 1k
R316 N331 N327 1k
XU109 N340 N337 VSS+ VSS- N337 LT1001  ; pins In+ In- V+ V- OUT
XU110 N340 N279 VSS+ VSS- N279 LT1001  ; pins In+ In- V+ V- OUT
R317 N296 N325 {LRB}
R318 N325 VGND {LR}
XU111 ERRORSIG N326 VSS+ VSS- N326 LT1001  ; pins In+ In- V+ V- OUT
D113 N299 N298 RB511VM-40
XU112 VGND N297 VSS+ VSS- N298 LT1001  ; pins In+ In- V+ V- OUT
R319 N297 N298 1k
R320 N273 N297 1k
D114 N299 N326 RB511VM-40
D115 N298 N335 RB511VM-40
D116 N326 N335 RB511VM-40
R321 VDD N299 500k
R322 N335 VGND 50k
D117 N291 N326 RB511VM-40
D118 N291 N273 RB511VM-40
D119 N326 N336 RB511VM-40
D120 N273 N336 RB511VM-40
R323 VDD N291 500k
R324 N336 VGND 50k
XU113 N292 N300 VSS+ VSS- N307 LT1001  ; pins In+ In- V+ V- OUT
R325 N300 N307 1k
R326 VGND N292 1k
R327 N300 N299 5k
R328 N300 N336 5k
R329 N292 N291 5k
R330 N292 N335 5k
R331 N335 N299 1k
R332 N336 N291 1k
R333 N307 N332 150
XU114 N332 N305 VSS+ VSS- N306 LT1001  ; pins In+ In- V+ V- OUT
R334 N305 N306 680
R335 VGND N305 330
XU115 N325 N273 VSS+ VSS- N273 LT1001  ; pins In+ In- V+ V- OUT
XU116 N338 T8 VSS+ VSS- T8 LT1001  ; pins In+ In- V+ V- OUT
D121 N315 N309 RB511VM-40
XU117 VGND N308 VSS+ VSS- N309 LT1001  ; pins In+ In- V+ V- OUT
R336 N308 N309 1k
R337 N279 N308 1k
D122 N315 N296 RB511VM-40
D123 N309 N341 RB511VM-40
D124 N296 N341 RB511VM-40
R338 VDD N315 500k
R339 N341 VGND 50k
D125 N310 N296 RB511VM-40
D126 N310 N279 RB511VM-40
D127 N296 N342 RB511VM-40
D128 N279 N342 RB511VM-40
R340 VDD N310 500k
R341 N342 VGND 50k
XU118 N311 N316 VSS+ VSS- N317 LT1001  ; pins In+ In- V+ V- OUT
R342 N316 N317 1k
R343 VGND N311 1k
R344 N316 N315 5k
R345 N316 N342 5k
R346 N311 N310 5k
R347 N311 N341 5k
R348 N341 N315 1k
R349 N342 N310 1k
R350 N317 N339 150
XU119 N339 N318 VSS+ VSS- N319 LT1001  ; pins In+ In- V+ V- OUT
R351 N318 N319 680
R352 N319 N338 150
R353 VGND N318 330
XU120 VOUT8 N296 VSS+ VSS- N296 LT1001  ; pins In+ In- V+ V- OUT
XU124 N045 N041 VSS+ VSS- N042 LT1001  ; pins In+ In- V+ V- OUT
R365 VGND N045 1k
R366 N045 N044 1k
R367 N041 N043 1k
R368 N042 N041 1k
XU125 N042 N046 VSS+ VSS- N046 LT1001  ; pins In+ In- V+ V- OUT
R369 VOUT N038 20k
C9 N038 VGND 500n
XU126 N038 N043 VSS+ VSS- N043 LT1001  ; pins In+ In- V+ V- OUT
R370 N046 ERRORSIG 7K
R371 ERRORSIG 0 1K
Vdd3 Wc 0 3.3
B1 N044 0 V=V(VIN)*V(VIN)
.model D D
.lib standard.dio
.model NMOS NMOS
.model PMOS PMOS
.lib standard.mos
.tran 1
.option noopiter
.param LR=1k
.param LRB=1K
.param c=1u
.lib LTC.lib
.backanno
.end

* Results of the author's LTspice run, read from the files saved beside the schematic
* Operating Point, zero values left out:
*   V(vint) = 400 mV
*   V(vdd) = 3.3 V
*   V(vss-) = -10 V
*   V(vss+) = 10 V
*   V(voffset) = 1 V
*   V(vref) = 2 V
*   V(vw) = 2.4 V
*   V(n011) = 1.43 µV
*   V(n012) = -1 V
*   V(n013) = -2.256 µV
*   V(n014) = 1.65 V
*   V(n018) = 1.43 µV
*   V(n019) = -1 V
*   V(n021) = -2.256 µV
*   V(n022) = 1.65 V
*   V(vpos) = 1.65 V
*   V(vneg) = 1.65 V
*   V(n005) = 2.106 µV
*   V(n002) = 3.13 V
*   V(spikes1) = 265.4 nV
*   V(n001) = 3.3 V
*   V(n007) = 165.2 nV
*   V(v0) = 757 mV
*   V(vout1) = 826.3 nV
*   V(n026) = 2.106 µV
*   V(n024) = 3.13 V
*   V(spikes2) = 265.4 nV
*   V(n020) = 3.3 V
*   V(n028) = 165.2 nV
*   V(v1) = 745.1 mV
*   V(vout2) = 826.3 nV
*   V(n037) = 2.106 µV
*   V(n032) = 3.13 V
*   V(spikes3) = 265.4 nV
*   V(n030) = 3.3 V
*   V(n040) = 165.2 nV
*   V(v2) = 733.2 mV
*   V(vout3) = 826.3 nV
*   V(n052) = 2.106 µV
*   V(n050) = 3.13 V
*   V(spikes4) = 265.4 nV
*   V(n048) = 3.3 V
*   V(n054) = 165.2 nV
*   V(v3) = 721.2 mV
*   V(vout4) = 826.3 nV
*   V(n006) = 2.106 µV
*   V(n004) = 3.13 V
*   V(spikes5) = 265.4 nV
*   V(n003) = 3.3 V
*   V(n008) = 165.2 nV
*   V(vout5) = 826.3 nV
*   V(n025) = 2.106 µV
*   V(n023) = 3.13 V
*   V(spikes6) = 265.4 nV
*   V(n016) = 3.3 V
*   V(n027) = 165.2 nV
*   V(vout6) = 826.3 nV
*   V(n036) = 2.106 µV
*   V(n031) = 3.13 V
*   V(spikes7) = 265.4 nV
*   V(n029) = 3.3 V
*   V(n039) = 165.2 nV
*   V(vout7) = 826.3 nV
*   V(n051) = 2.106 µV
*   V(n049) = 3.13 V
*   V(spikes8) = 265.4 nV
*   V(n047) = 3.3 V
*   V(n053) = 165.2 nV
*   V(vout8) = 826.3 nV
*   V(v4) = 709.3 mV
*   V(wc) = 3.3 V
*   V(n060) = 826.3 nV
*   V(n085) = 413.2 nV
*   V(n064) = 19.24 mV
*   V(n062) = -413.1 nV
*   V(n055) = 413.2 nV
*   V(n104) = 16.29 mV
*   V(n058) = 19.24 mV
*   V(n105) = 16.29 mV
*   V(n065) = 5.076 mV
*   V(n059) = 5.076 mV
*   V(n073) = 19.24 mV
*   V(n117) = 16.29 mV
*   V(n071) = 19.24 mV
*   V(n118) = 16.29 mV
*   V(n074) = 5.076 mV
*   V(n072) = 5.076 mV
*   V(n132) = 826.3 nV
*   V(n157) = 413.2 nV
*   V(n136) = 19.24 mV
*   V(n134) = -413.1 nV
*   V(n127) = 413.2 nV
*   V(n176) = 16.29 mV
*   V(n130) = 19.24 mV
*   V(n177) = 16.29 mV
*   V(n137) = 5.076 mV
*   V(n131) = 5.076 mV
*   V(n145) = 19.24 mV
*   V(n189) = 16.29 mV
*   V(n143) = 19.24 mV
*   V(n190) = 16.29 mV
*   V(n146) = 5.076 mV
*   V(n144) = 5.076 mV
*   V(n204) = 826.3 nV
*   V(n229) = 413.2 nV
*   V(n208) = 19.24 mV
*   V(n206) = -413.1 nV
*   V(n199) = 413.2 nV
*   V(n248) = 16.29 mV
*   V(n202) = 19.24 mV
*   V(n249) = 16.29 mV
*   V(n209) = 5.076 mV
*   V(n203) = 5.076 mV
*   V(n217) = 19.24 mV
*   V(n261) = 16.29 mV
*   V(n215) = 19.24 mV
*   V(n262) = 16.29 mV
*   V(n218) = 5.076 mV
*   V(n216) = 5.076 mV
*   V(n276) = 826.3 nV
*   V(n301) = 413.2 nV
*   V(n280) = 19.24 mV
*   V(n278) = -413.1 nV
*   V(n271) = 413.2 nV
*   V(n320) = 16.29 mV
*   V(n274) = 19.24 mV
*   V(n321) = 16.29 mV
*   V(n281) = 5.076 mV
*   V(n275) = 5.076 mV
*   V(n289) = 19.24 mV
*   V(n333) = 16.29 mV
*   V(n287) = 19.24 mV
*   V(n334) = 16.29 mV
*   V(n290) = 5.076 mV
*   V(n288) = 5.076 mV
*   V(n080) = 826.3 nV
*   V(n109) = 413.2 nV
*   V(n083) = 19.24 mV
*   V(n082) = -413.1 nV
*   V(n057) = 413.2 nV
*   V(n119) = 16.29 mV
*   V(n075) = 19.24 mV
*   V(n120) = 16.29 mV
*   V(n084) = 5.076 mV
*   V(n076) = 5.076 mV
*   V(n099) = 19.24 mV
*   V(n125) = 16.29 mV
*   V(n094) = 19.24 mV
*   V(n126) = 16.29 mV
*   V(n100) = 5.076 mV
*   V(n095) = 5.076 mV
*   V(n152) = 826.3 nV
*   V(n181) = 413.2 nV
*   V(n155) = 19.24 mV
*   V(n154) = -413.1 nV
*   V(n129) = 413.2 nV
*   V(n191) = 16.29 mV
*   V(n147) = 19.24 mV
*   V(n192) = 16.29 mV
*   V(n156) = 5.076 mV
*   V(n148) = 5.076 mV
*   V(n171) = 19.24 mV
*   V(n197) = 16.29 mV
*   V(n166) = 19.24 mV
*   V(n198) = 16.29 mV
*   V(n172) = 5.076 mV
*   V(n167) = 5.076 mV
*   V(n224) = 826.3 nV
*   V(n253) = 413.2 nV
*   V(n227) = 19.24 mV
*   V(n226) = -413.1 nV
*   V(n201) = 413.2 nV
*   V(n263) = 16.29 mV
*   V(n219) = 19.24 mV
*   V(n264) = 16.29 mV
*   V(n228) = 5.076 mV
*   V(n220) = 5.076 mV
*   V(n243) = 19.24 mV
*   V(n269) = 16.29 mV
*   V(n238) = 19.24 mV
*   V(n270) = 16.29 mV
*   V(n244) = 5.076 mV
*   V(n239) = 5.076 mV
*   V(n296) = 826.3 nV
*   V(n325) = 413.2 nV
*   V(n299) = 19.24 mV
*   V(n298) = -413.1 nV
*   V(n273) = 413.2 nV
*   V(n335) = 16.29 mV
*   V(n291) = 19.24 mV
*   V(n336) = 16.29 mV
*   V(n300) = 5.076 mV
*   V(n292) = 5.076 mV
*   V(n315) = 19.24 mV
*   V(n341) = 16.29 mV
*   V(n310) = 19.24 mV
*   V(n342) = 16.29 mV
*   V(n316) = 5.076 mV
*   V(n311) = 5.076 mV
*   Id(M16) = 6.61 pA
*   Is(M16) = -6.61 pA
*   Id(M15) = 6.61 pA
*   Ib(M15) = -3.31 pA
*   Is(M15) = -3.3 pA
*   Id(Mnnot16) = 6.61 pA
*   Is(Mnnot16) = -6.61 pA
*   Id(Mvlk8) = 30.38 pA
*   Is(Mvlk8) = -30.38 pA
*   Id(Mvref8) = 6.61 pA
*   Is(Mvref8) = -6.61 pA
*   Id(Mnnot15) = 6.61 pA
*   Ib(Mnnot15) = -3.31 pA
*   Is(Mnnot15) = -3.3 pA
*   Id(M14) = 6.61 pA
*   Is(M14) = -6.61 pA
*   Id(M13) = 6.61 pA
*   Ib(M13) = -3.31 pA
*   Is(M13) = -3.3 pA
*   Id(Mnnot14) = 6.61 pA
*   Is(Mnnot14) = -6.61 pA
*   Id(Mvlk7) = 30.88 pA
*   Is(Mvlk7) = -30.88 pA
*   Id(Mvref7) = 6.61 pA
*   Is(Mvref7) = -6.61 pA
*   Id(Mnnot13) = 6.61 pA
*   Ib(Mnnot13) = -3.31 pA
*   Is(Mnnot13) = -3.3 pA
*   Id(M12) = 6.61 pA
*   Is(M12) = -6.61 pA
*   Id(M11) = 6.61 pA
*   Ib(M11) = -3.31 pA
*   Is(M11) = -3.3 pA
*   Id(Mnnot12) = 6.61 pA
*   Is(Mnnot12) = -6.61 pA
*   Id(Mvlk6) = 31.39 pA
*   Is(Mvlk6) = -31.39 pA
*   Id(Mvref6) = 6.61 pA
*   Is(Mvref6) = -6.61 pA
*   Id(Mnnot11) = 6.61 pA
*   Ib(Mnnot11) = -3.31 pA
*   Is(Mnnot11) = -3.3 pA
*   Id(M10) = 6.61 pA
*   Is(M10) = -6.61 pA
*   Id(M9) = 6.61 pA
*   Ib(M9) = -3.31 pA
*   Is(M9) = -3.3 pA
*   Id(Mnnot10) = 6.61 pA
*   Is(Mnnot10) = -6.61 pA
*   Id(Mvlk5) = 31.89 pA
*   Is(Mvlk5) = -31.89 pA
*   Id(Mvref5) = 6.61 pA
*   Is(Mvref5) = -6.61 pA
*   Id(Mnnot9) = 6.61 pA
*   Ib(Mnnot9) = -3.31 pA
*   Is(Mnnot9) = -3.3 pA
*   Id(M8) = 6.61 pA
*   Is(M8) = -6.61 pA
*   Id(M7) = 6.61 pA
*   Ib(M7) = -3.31 pA
*   Is(M7) = -3.3 pA
*   Id(Mnnot8) = 6.61 pA
*   Is(Mnnot8) = -6.61 pA
*   Id(Mvlk4) = 30.38 pA
*   Is(Mvlk4) = -30.38 pA
*   Id(Mvref4) = 6.61 pA
*   Is(Mvref4) = -6.61 pA
*   Id(Mnnot7) = 6.61 pA
*   Ib(Mnnot7) = -3.31 pA
*   Is(Mnnot7) = -3.3 pA
*   Id(M6) = 6.61 pA
*   Is(M6) = -6.61 pA
*   Id(M5) = 6.61 pA
*   Ib(M5) = -3.31 pA
*   Is(M5) = -3.3 pA
*   Id(Mnnot6) = 6.61 pA
*   Is(Mnnot6) = -6.61 pA
*   Id(Mvlk3) = 30.88 pA
*   Is(Mvlk3) = -30.88 pA
*   Id(Mvref3) = 6.61 pA
*   Is(Mvref3) = -6.61 pA
*   Id(Mnnot5) = 6.61 pA
*   Ib(Mnnot5) = -3.31 pA
*   Is(Mnnot5) = -3.3 pA
*   Id(M4) = 6.61 pA
*   Is(M4) = -6.61 pA
*   Id(M3) = 6.61 pA
*   Ib(M3) = -3.31 pA
*   Is(M3) = -3.3 pA
*   Id(Mnnot4) = 6.61 pA
*   Is(Mnnot4) = -6.61 pA
*   Id(Mvlk2) = 31.39 pA
*   Is(Mvlk2) = -31.39 pA
*   Id(Mvref2) = 6.61 pA
*   Is(Mvref2) = -6.61 pA
*   Id(Mnnot3) = 6.61 pA
*   Ib(Mnnot3) = -3.31 pA
*   Is(Mnnot3) = -3.3 pA
*   Id(M2) = 6.61 pA
*   Is(M2) = -6.61 pA
*   Id(M1) = 6.61 pA
*   Ib(M1) = -3.31 pA
*   Is(M1) = -3.3 pA
*   Id(Mnnot2) = 6.61 pA
*   Is(Mnnot2) = -6.61 pA
*   Id(Mvlk1) = 31.89 pA
*   Is(Mvlk1) = -31.89 pA
*   Id(Mvref1) = 6.61 pA
*   Is(Mvref1) = -6.61 pA
*   Id(Mnnot1) = 6.61 pA
*   Ib(Mnnot1) = -3.31 pA
*   Is(Mnnot1) = -3.3 pA
*   Id(Mpnot16) = -6.61 pA
*   Ib(Mpnot16) = 3.31 pA
*   Is(Mpnot16) = 3.3 pA
*   Id(Min8) = -5.326 µA
*   Is(Min8) = 5.326 µA
*   Id(Mina8) = -6.61 pA
*   Ib(Mina8) = 3.31 pA
*   Is(Mina8) = 3.3 pA
*   Id(Mpnot15) = -6.61 pA
*   Is(Mpnot15) = 6.61 pA
*   Id(Mw8) = -5.326 µA
*   Ib(Mw8) = 3.14 pA
*   Is(Mw8) = 5.326 µA
*   Id(Mpnot14) = -6.61 pA
*   Ib(Mpnot14) = 3.31 pA
*   Is(Mpnot14) = 3.3 pA
*   Id(Min7) = -5.326 µA
*   Is(Min7) = 5.326 µA
*   Id(Mina7) = -6.61 pA
*   Ib(Mina7) = 3.31 pA
*   Is(Mina7) = 3.3 pA
*   Id(Mpnot13) = -6.61 pA
*   Is(Mpnot13) = 6.61 pA
*   Id(Mw7) = -5.326 µA
*   Ib(Mw7) = 3.14 pA
*   Is(Mw7) = 5.326 µA
*   Id(Mpnot12) = -6.61 pA
*   Ib(Mpnot12) = 3.31 pA
*   Is(Mpnot12) = 3.3 pA
*   Id(Min6) = -5.326 µA
*   Is(Min6) = 5.326 µA
*   Id(Mina6) = -6.61 pA
*   Ib(Mina6) = 3.31 pA
*   Is(Mina6) = 3.3 pA
*   Id(Mpnot11) = -6.61 pA
*   Is(Mpnot11) = 6.61 pA
*   Id(Mw6) = -5.326 µA
*   Ib(Mw6) = 3.14 pA
*   Is(Mw6) = 5.326 µA
*   Id(Mpnot10) = -6.61 pA
*   Ib(Mpnot10) = 3.31 pA
*   Is(Mpnot10) = 3.3 pA
*   Id(Min5) = -5.326 µA
*   Is(Min5) = 5.326 µA
*   Id(Mina5) = -6.61 pA
*   Ib(Mina5) = 3.31 pA
*   Is(Mina5) = 3.3 pA
*   Id(Mpnot9) = -6.61 pA
*   Is(Mpnot9) = 6.61 pA
*   Id(Mw5) = -5.326 µA
*   Ib(Mw5) = 3.14 pA
*   Is(Mw5) = 5.326 µA
*   Id(Mpnot8) = -6.61 pA
*   Ib(Mpnot8) = 3.31 pA
*   Is(Mpnot8) = 3.3 pA
*   Id(Min4) = -5.326 µA
*   Is(Min4) = 5.326 µA
*   Id(Mina4) = -6.61 pA
*   Ib(Mina4) = 3.31 pA
*   Is(Mina4) = 3.3 pA
*   Id(Mpnot7) = -6.61 pA
*   Is(Mpnot7) = 6.61 pA
*   Id(Mw4) = -5.326 µA
*   Ib(Mw4) = 3.14 pA
*   Is(Mw4) = 5.326 µA
*   Id(Mpnot6) = -6.61 pA
*   Ib(Mpnot6) = 3.31 pA
*   Is(Mpnot6) = 3.3 pA
*   Id(Min3) = -5.326 µA
*   Is(Min3) = 5.326 µA
*   Id(Mina3) = -6.61 pA
*   Ib(Mina3) = 3.31 pA
*   Is(Mina3) = 3.3 pA
*   Id(Mpnot5) = -6.61 pA
*   Is(Mpnot5) = 6.61 pA
*   Id(Mw3) = -5.326 µA
*   Ib(Mw3) = 3.14 pA
*   Is(Mw3) = 5.326 µA
*   Id(Mpnot4) = -6.61 pA
*   Ib(Mpnot4) = 3.31 pA
*   Is(Mpnot4) = 3.3 pA
*   Id(Min2) = -5.326 µA
*   Is(Min2) = 5.326 µA
*   Id(Mina2) = -6.61 pA
*   Ib(Mina2) = 3.31 pA
*   Is(Mina2) = 3.3 pA
*   Id(Mpnot3) = -6.61 pA
*   Is(Mpnot3) = 6.61 pA
*   Id(Mw2) = -5.326 µA
*   Ib(Mw2) = 3.14 pA
*   Is(Mw2) = 5.326 µA
*   Id(Mpnot2) = -6.61 pA
*   Ib(Mpnot2) = 3.31 pA
*   Is(Mpnot2) = 3.3 pA
*   Id(Min1) = -5.326 µA
*   Is(Min1) = 5.326 µA
*   Id(Mina1) = -6.61 pA
*   Ib(Mina1) = 3.31 pA
*   Is(Mina1) = 3.3 pA
*   Id(Mpnot1) = -6.61 pA
*   Is(Mpnot1) = 6.61 pA
*   Id(Mw1) = -5.326 µA
*   Ib(Mw1) = 3.14 pA
*   Is(Mw1) = 5.326 µA
*   I(Csyn8) = 5.326 µA
*   I(Csyn7) = 5.326 µA
*   I(Csyn6) = 5.326 µA
*   I(Csyn5) = 5.326 µA
*   I(Csyn4) = 5.326 µA
*   I(Csyn3) = 5.326 µA
*   I(Csyn2) = 5.326 µA
*   I(Csyn1) = 5.326 µA
*   I(D128) = -190.8 nA
*   I(D127) = -190.8 nA
*   I(D126) = 389 nA
*   I(D125) = 389 nA
*   I(D124) = -190.8 nA
*   I(D123) = -190.8 nA
*   I(D122) = 389 nA
*   I(D121) = 389 nA
*   I(D120) = -190.8 nA
*   I(D119) = -190.8 nA
*   I(D118) = 389 nA
*   I(D117) = 389 nA
*   I(D116) = -190.8 nA
*   I(D115) = -190.8 nA
*   I(D114) = 389 nA
*   I(D113) = 389 nA
*   I(D112) = -190.8 nA
*   I(D111) = -190.8 nA
*   I(D110) = 389 nA
*   I(D109) = 389 nA
*   I(D108) = -190.8 nA
*   I(D107) = -190.8 nA
*   I(D106) = 389 nA
*   I(D105) = 389 nA
*   I(D104) = -190.8 nA
*   I(D103) = -190.8 nA
*   I(D102) = 389 nA
*   I(D101) = 389 nA
*   I(D100) = -190.8 nA
*   I(D99) = -190.8 nA
*   I(D98) = 389 nA
*   I(D97) = 389 nA
*   I(D96) = -190.8 nA
*   I(D95) = -190.8 nA
*   I(D94) = 389 nA
*   I(D93) = 389 nA
*   I(D92) = -190.8 nA
*   I(D91) = -190.8 nA
*   I(D90) = 389 nA
*   I(D89) = 389 nA
*   I(D88) = -190.8 nA
*   I(D87) = -190.8 nA
*   I(D86) = 389 nA
*   I(D85) = 389 nA
*   I(D84) = -190.8 nA
*   I(D83) = -190.8 nA
*   I(D82) = 389 nA
*   I(D81) = 389 nA
*   I(D80) = -190.8 nA
*   I(D79) = -190.8 nA
*   I(D78) = 389 nA
*   I(D77) = 389 nA
*   I(D76) = -190.8 nA
*   I(D75) = -190.8 nA
*   I(D74) = 389 nA
*   I(D73) = 389 nA
*   I(D72) = -190.8 nA
*   I(D71) = -190.8 nA
*   I(D70) = 389 nA
*   I(D69) = 389 nA
*   I(D68) = -190.8 nA
*   I(D67) = -190.8 nA
*   I(D66) = 389 nA
*   I(D65) = 389 nA
*   I(D64) = -190.8 nA
*   I(D63) = -190.8 nA
*   I(D62) = 389 nA
*   I(D61) = 389 nA
*   I(D60) = -190.8 nA
*   I(D59) = -190.8 nA
*   I(D58) = 389 nA
*   I(D57) = 389 nA
*   I(D56) = -190.8 nA
*   I(D55) = -190.8 nA
*   I(D54) = 389 nA
*   I(D53) = 389 nA
*   I(D52) = -190.8 nA
*   I(D51) = -190.8 nA
*   I(D50) = 389 nA
*   I(D49) = 389 nA
*   I(D48) = -190.8 nA
*   I(D47) = -190.8 nA
*   I(D46) = 389 nA
*   I(D45) = 389 nA
*   I(D44) = -190.8 nA
*   I(D43) = -190.8 nA
*   I(D42) = 389 nA
*   I(D41) = 389 nA
*   I(D40) = -190.8 nA
*   I(D39) = -190.8 nA
*   I(D38) = 389 nA
*   I(D37) = 389 nA
*   I(D36) = -190.8 nA
*   I(D35) = -190.8 nA
*   I(D34) = 389 nA
*   I(D33) = 389 nA
*   I(D32) = -190.8 nA
*   I(D31) = -190.8 nA
*   I(D30) = 389 nA
*   I(D29) = 389 nA
*   I(D28) = -190.8 nA
*   I(D27) = -190.8 nA
*   I(D26) = 389 nA
*   I(D25) = 389 nA
*   I(D24) = -190.8 nA
*   I(D23) = -190.8 nA
*   I(D22) = 389 nA
*   I(D21) = 389 nA
*   I(D20) = -190.8 nA
*   I(D19) = -190.8 nA
*   I(D18) = 389 nA
*   I(D17) = 389 nA
*   I(D16) = -190.8 nA
*   I(D15) = -190.8 nA
*   I(D14) = 389 nA
*   I(D13) = 389 nA
*   I(D12) = -190.8 nA
*   I(D11) = -190.8 nA
*   I(D10) = 389 nA
*   I(D9) = 389 nA
*   I(D8) = -190.8 nA
*   I(D7) = -190.8 nA
*   I(D6) = 389 nA
*   I(D5) = 389 nA
*   I(D4) = -190.8 nA
*   I(D3) = -190.8 nA
*   I(D2) = 389 nA
*   I(D1) = 389 nA
*   I(R368) = -7.611 pA
*   I(R367) = -7.611 pA
*   I(R349) = -2.95 µA
*   I(R348) = -2.95 µA
*   I(R347) = -2.243 µA
*   I(R346) = -2.833 µA
*   I(R345) = -2.243 µA
*   I(R344) = -2.833 µA
*   I(R343) = -5.076 µA
*   I(R342) = 5.076 µA
*   I(R341) = 325.8 nA
*   I(R340) = 6.562 µA
*   I(R339) = 325.8 nA
*   I(R338) = 6.562 µA
*   I(R335) = -4.61 pA
*   I(R334) = -4.61 pA
*   I(R332) = -2.95 µA
*   I(R331) = -2.95 µA
*   I(R330) = -2.243 µA
*   I(R329) = -2.833 µA
*   I(R328) = -2.243 µA
*   I(R327) = -2.833 µA
*   I(R326) = -5.076 µA
*   I(R325) = 5.076 µA
*   I(R324) = 325.8 nA
*   I(R323) = 6.562 µA
*   I(R322) = 325.8 nA
*   I(R321) = 6.562 µA
*   I(R320) = 413.1 pA
*   I(R319) = 413.1 pA
*   I(R318) = 413.2 pA
*   I(R317) = 413.2 pA
*   I(R316) = -4.656 pA
*   I(R315) = -4.656 pA
*   I(R313) = -4.656 pA
*   I(R312) = -4.656 pA
*   I(R307) = -2.95 µA
*   I(R306) = -2.95 µA
*   I(R305) = -2.243 µA
*   I(R304) = -2.833 µA
*   I(R303) = -2.243 µA
*   I(R302) = -2.833 µA
*   I(R301) = -5.076 µA
*   I(R300) = 5.076 µA
*   I(R299) = 325.8 nA
*   I(R298) = 6.562 µA
*   I(R297) = 325.8 nA
*   I(R296) = 6.562 µA
*   I(R293) = -4.61 pA
*   I(R292) = -4.61 pA
*   I(R290) = -2.95 µA
*   I(R289) = -2.95 µA
*   I(R288) = -2.243 µA
*   I(R287) = -2.833 µA
*   I(R286) = -2.243 µA
*   I(R285) = -2.833 µA
*   I(R284) = -5.076 µA
*   I(R283) = 5.076 µA
*   I(R282) = 325.8 nA
*   I(R281) = 6.562 µA
*   I(R280) = 325.8 nA
*   I(R279) = 6.562 µA
*   I(R278) = 413.1 pA
*   I(R277) = 413.1 pA
*   I(R276) = 413.2 pA
*   I(R275) = 413.2 pA
*   I(R274) = -4.656 pA
*   I(R273) = -4.656 pA
*   I(R271) = -4.656 pA
*   I(R270) = -4.656 pA
*   I(R265) = -2.95 µA
*   I(R264) = -2.95 µA
*   I(R263) = -2.243 µA
*   I(R262) = -2.833 µA
*   I(R261) = -2.243 µA
*   I(R260) = -2.833 µA
*   I(R259) = -5.076 µA
*   I(R258) = 5.076 µA
*   I(R257) = 325.8 nA
*   I(R256) = 6.562 µA
*   I(R255) = 325.8 nA
*   I(R254) = 6.562 µA
*   I(R251) = -4.61 pA
*   I(R250) = -4.61 pA
*   I(R248) = -2.95 µA
*   I(R247) = -2.95 µA
*   I(R246) = -2.243 µA
*   I(R245) = -2.833 µA
*   I(R244) = -2.243 µA
*   I(R243) = -2.833 µA
*   I(R242) = -5.076 µA
*   I(R241) = 5.076 µA
*   I(R240) = 325.8 nA
*   I(R239) = 6.562 µA
*   I(R238) = 325.8 nA
*   I(R237) = 6.562 µA
*   I(R236) = 413.1 pA
*   I(R235) = 413.1 pA
*   I(R234) = 413.2 pA
*   I(R233) = 413.2 pA
*   I(R232) = -4.656 pA
*   I(R231) = -4.656 pA
*   I(R229) = -4.656 pA
*   I(R228) = -4.656 pA
*   I(R223) = -2.95 µA
*   I(R222) = -2.95 µA
*   I(R221) = -2.243 µA
*   I(R220) = -2.833 µA
*   I(R219) = -2.243 µA
*   I(R218) = -2.833 µA
*   I(R217) = -5.076 µA
*   I(R216) = 5.076 µA
*   I(R215) = 325.8 nA
*   I(R214) = 6.562 µA
*   I(R213) = 325.8 nA
*   I(R212) = 6.562 µA
*   I(R209) = -4.61 pA
*   I(R208) = -4.61 pA
*   I(R206) = -2.95 µA
*   I(R205) = -2.95 µA
*   I(R204) = -2.243 µA
*   I(R203) = -2.833 µA
*   I(R202) = -2.243 µA
*   I(R201) = -2.833 µA
*   I(R200) = -5.076 µA
*   I(R199) = 5.076 µA
*   I(R198) = 325.8 nA
*   I(R197) = 6.562 µA
*   I(R196) = 325.8 nA
*   I(R195) = 6.562 µA
*   I(R194) = 413.1 pA
*   I(R193) = 413.1 pA
*   I(R192) = 413.2 pA
*   I(R191) = 413.2 pA
*   I(R190) = -4.656 pA
*   I(R189) = -4.656 pA
*   I(R187) = -4.656 pA
*   I(R186) = -4.656 pA
*   I(R181) = -2.95 µA
*   I(R180) = -2.95 µA
*   I(R179) = -2.243 µA
*   I(R178) = -2.833 µA
*   I(R177) = -2.243 µA
*   I(R176) = -2.833 µA
*   I(R175) = -5.076 µA
*   I(R174) = 5.076 µA
*   I(R173) = 325.8 nA
*   I(R172) = 6.562 µA
*   I(R171) = 325.8 nA
*   I(R170) = 6.562 µA
*   I(R167) = -4.61 pA
*   I(R166) = -4.61 pA
*   I(R164) = -2.95 µA
*   I(R163) = -2.95 µA
*   I(R162) = -2.243 µA
*   I(R161) = -2.833 µA
*   I(R160) = -2.243 µA
*   I(R159) = -2.833 µA
*   I(R158) = -5.076 µA
*   I(R157) = 5.076 µA
*   I(R156) = 325.8 nA
*   I(R155) = 6.562 µA
*   I(R154) = 325.8 nA
*   I(R153) = 6.562 µA
*   I(R152) = 413.1 pA
*   I(R151) = 413.1 pA
*   I(R150) = 413.2 pA
*   I(R149) = 413.2 pA
*   I(R148) = -4.656 pA
*   I(R147) = -4.656 pA
*   I(R145) = -4.656 pA
*   I(R144) = -4.656 pA
*   I(R139) = -2.95 µA
*   I(R138) = -2.95 µA
*   I(R137) = -2.243 µA
*   I(R136) = -2.833 µA
*   I(R135) = -2.243 µA
*   I(R134) = -2.833 µA
*   I(R133) = -5.076 µA
*   I(R132) = 5.076 µA
*   I(R131) = 325.8 nA
*   I(R130) = 6.562 µA
*   I(R129) = 325.8 nA
*   I(R128) = 6.562 µA
*   I(R125) = -4.61 pA
*   I(R124) = -4.61 pA
*   I(R122) = -2.95 µA
*   I(R121) = -2.95 µA
*   I(R120) = -2.243 µA
*   I(R119) = -2.833 µA
*   I(R118) = -2.243 µA
*   I(R117) = -2.833 µA
*   I(R116) = -5.076 µA
*   I(R115) = 5.076 µA
*   I(R114) = 325.8 nA
*   I(R113) = 6.562 µA
*   I(R112) = 325.8 nA
*   I(R111) = 6.562 µA
*   I(R110) = 413.1 pA
*   I(R109) = 413.1 pA
*   I(R108) = 413.2 pA
*   I(R107) = 413.2 pA
*   I(R106) = -4.656 pA
*   I(R105) = -4.656 pA
*   I(R103) = -4.656 pA
*   I(R102) = -4.656 pA
*   I(R97) = -2.95 µA
*   I(R96) = -2.95 µA
*   I(R95) = -2.243 µA
*   I(R94) = -2.833 µA
*   I(R93) = -2.243 µA
*   I(R92) = -2.833 µA
*   I(R91) = -5.076 µA
*   I(R90) = 5.076 µA
*   I(R89) = 325.8 nA
*   I(R88) = 6.562 µA
*   I(R87) = 325.8 nA
*   I(R86) = 6.562 µA
*   I(R83) = -4.61 pA
*   I(R82) = -4.61 pA
*   I(R80) = -2.95 µA
*   I(R79) = -2.95 µA
*   I(R78) = -2.243 µA
*   I(R77) = -2.833 µA
*   I(R76) = -2.243 µA
*   I(R75) = -2.833 µA
*   I(R74) = -5.076 µA
*   I(R73) = 5.076 µA
*   I(R72) = 325.8 nA
*   I(R71) = 6.562 µA
*   I(R70) = 325.8 nA
*   I(R69) = 6.562 µA
*   I(R68) = 413.1 pA
*   I(R67) = 413.1 pA
*   I(R66) = 413.2 pA
*   I(R65) = 413.2 pA
*   I(R64) = -4.656 pA
*   I(R63) = -4.656 pA
*   I(R61) = -4.656 pA
*   I(R60) = -4.656 pA
*   I(R55) = -2.95 µA
*   I(R54) = -2.95 µA
*   I(R53) = -2.243 µA
*   I(R52) = -2.833 µA
*   I(R51) = -2.243 µA
*   I(R50) = -2.833 µA
*   I(R49) = -5.076 µA
*   I(R48) = 5.076 µA
*   I(R47) = 325.8 nA
*   I(R46) = 6.562 µA
*   I(R45) = 325.8 nA
*   I(R44) = 6.562 µA
*   I(R41) = -4.61 pA
*   I(R40) = -4.61 pA
*   I(R38) = -2.95 µA
*   I(R37) = -2.95 µA
*   I(R36) = -2.243 µA
*   I(R35) = -2.833 µA
*   I(R34) = -2.243 µA
*   I(R33) = -2.833 µA
*   I(R32) = -5.076 µA
*   I(R31) = 5.076 µA
*   I(R30) = 325.8 nA
*   I(R29) = 6.562 µA
*   I(R28) = 325.8 nA
*   I(R27) = 6.562 µA
*   I(R26) = 413.1 pA
*   I(R25) = 413.1 pA
*   I(R24) = 413.2 pA
*   I(R23) = 413.2 pA
*   I(R22) = -4.656 pA
*   I(R9) = -4.656 pA
*   I(R7) = -4.656 pA
*   I(R6) = -4.656 pA
*   I(R356) = -7.611 pA
*   I(R355) = -7.611 pA
*   I(R354) = -7.611 pA
*   I(R5) = 1.192 µA
*   I(R4) = 1.192 µA
*   I(R3) = 1.192 µA
*   I(R2) = 1.192 µA
*   I(R1) = 1.192 µA
*   I(R21) = 1 mA
*   I(R20) = 1 mA
*   I(R19) = -1 mA
*   I(R18) = 1.43 nA
*   I(R17) = -1 mA
*   I(R16) = 1 mA
*   I(R15) = 1 mA
*   I(R14) = -1 mA
*   I(R13) = 1.43 nA
*   I(R12) = -1 mA
*   I(V3) = -1.192 µA
*   I(Vdd2) = 91.65 µA
*   I(Voff1) = -2 mA
*   I(V2) = -282.7 mA
*   I(V1) = 284.8 mA
*   I(Vdd1) = -252.6 µA